# Altium project Senior Design.PrjPcb (part 2 of 2)

## Sheet Volt_Measurement.SchDoc
size Letter; SheetNumber: 2; SheetTotal: 3; SheetName: Volt Measurement
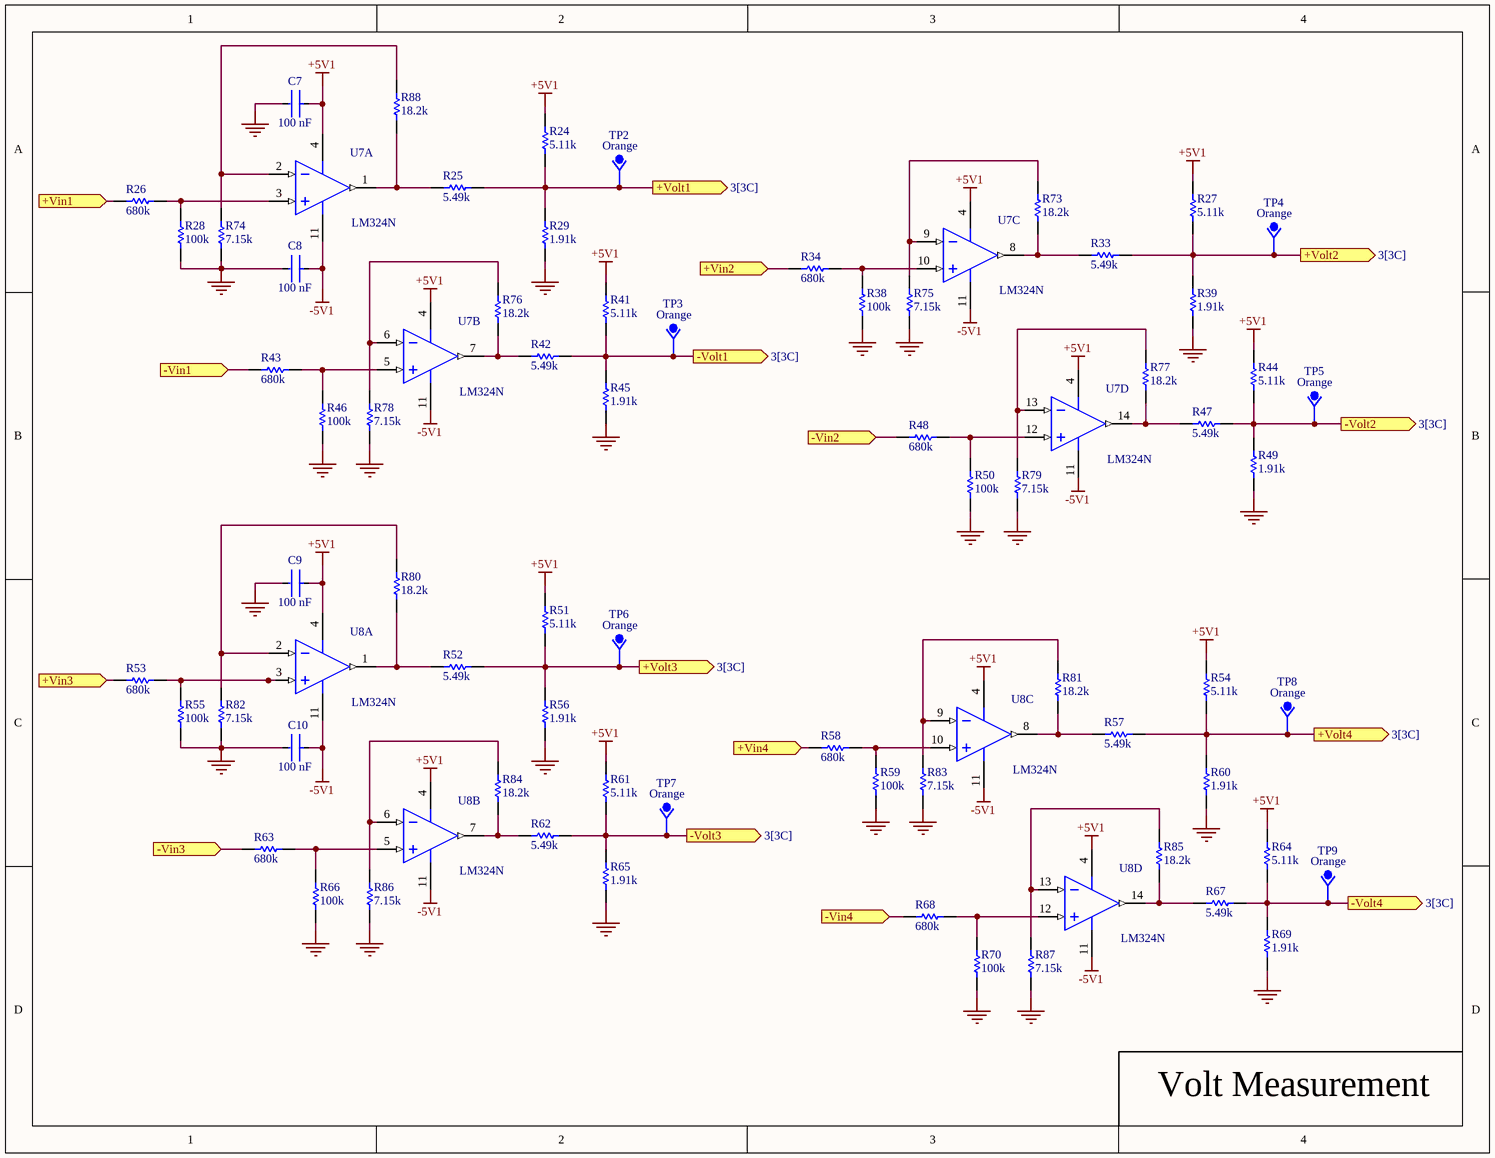
[diagram p1: Volt_Measurement.SchDoc]

### Parts
C7  value 100 nF  [FP-CC0805-0_85-MFG]  (hidden comment: 100nF)
C8  value 100 nF  [FP-CC0805-0_85-MFG]  (hidden comment: 100nF)
C9  value 100 nF  [FP-CC0805-0_85-MFG]  (hidden comment: 100nF)
C10  value 100 nF  [FP-CC0805-0_85-MFG]  (hidden comment: 100nF)
R24  value 5.11k  [0805 Res]  (hidden comment: 5.11k Ohm)
R25  value 5.49k  [0805 Res]  (hidden comment: 5.49k Ohm)
R26  value 680k  [0805 Res]  (hidden comment: 680k Ohm)
R27  value 5.11k  [0805 Res]  (hidden comment: 5.11k Ohm)
R28  value 100k  [0805 Res]  (hidden comment: 100k Ohm)
R29  value 1.91k  [0805 Res]  (hidden comment: 1.91k Ohm)
R33  value 5.49k  [0805 Res]  (hidden comment: 5.49k Ohm)
R34  value 680k  [0805 Res]  (hidden comment: 680k Ohm)
R38  value 100k  [0805 Res]  (hidden comment: 100k Ohm)
R39  value 1.91k  [0805 Res]  (hidden comment: 1.91k Ohm)
R41  value 5.11k  [0805 Res]  (hidden comment: 5.11k Ohm)
R42  value 5.49k  [0805 Res]  (hidden comment: 5.49k Ohm)
R43  value 680k  [0805 Res]  (hidden comment: 680k Ohm)
R44  value 5.11k  [0805 Res]  (hidden comment: 5.11k Ohm)
R45  value 1.91k  [0805 Res]  (hidden comment: 1.91k Ohm)
R46  value 100k  [0805 Res]  (hidden comment: 100k Ohm)
R47  value 5.49k  [0805 Res]  (hidden comment: 5.49k Ohm)
R48  value 680k  [0805 Res]  (hidden comment: 680k Ohm)
R49  value 1.91k  [0805 Res]  (hidden comment: 1.91k Ohm)
R50  value 100k  [0805 Res]  (hidden comment: 100k Ohm)
R51  value 5.11k  [0805 Res]  (hidden comment: 5.11k Ohm)
R52  value 5.49k  [0805 Res]  (hidden comment: 5.49k Ohm)
R53  value 680k  [0805 Res]  (hidden comment: 680k Ohm)
R54  value 5.11k  [0805 Res]  (hidden comment: 5.11k Ohm)
R55  value 100k  [0805 Res]  (hidden comment: 100k Ohm)
R56  value 1.91k  [0805 Res]  (hidden comment: 1.91k Ohm)
R57  value 5.49k  [0805 Res]  (hidden comment: 5.49k Ohm)
R58  value 680k  [0805 Res]  (hidden comment: 680k Ohm)
R59  value 100k  [0805 Res]  (hidden comment: 100k Ohm)
R60  value 1.91k  [0805 Res]  (hidden comment: 1.91k Ohm)
R61  value 5.11k  [0805 Res]  (hidden comment: 5.11k Ohm)
R62  value 5.49k  [0805 Res]  (hidden comment: 5.49k Ohm)
R63  value 680k  [0805 Res]  (hidden comment: 680k Ohm)
R64  value 5.11k  [0805 Res]  (hidden comment: 5.11k Ohm)
R65  value 1.91k  [0805 Res]  (hidden comment: 1.91k Ohm)
R66  value 100k  [0805 Res]  (hidden comment: 100k Ohm)
R67  value 5.49k  [0805 Res]  (hidden comment: 5.49k Ohm)
R68  value 680k  [0805 Res]  (hidden comment: 680k Ohm)
R69  value 1.91k  [0805 Res]  (hidden comment: 1.91k Ohm)
R70  value 100k  [0805 Res]  (hidden comment: 100k Ohm)
R73  value 18.2k  [0805 Res]  (hidden comment: 18.2k Ohm)
R74  value 7.15k  [0805 Res]  (hidden comment: 7.15k Ohm)
R75  value 7.15k  [0805 Res]  (hidden comment: 7.15k Ohm)
R76  value 18.2k  [0805 Res]  (hidden comment: 18.2k Ohm)
R77  value 18.2k  [0805 Res]  (hidden comment: 18.2k Ohm)
R78  value 7.15k  [0805 Res]  (hidden comment: 7.15k Ohm)
R79  value 7.15k  [0805 Res]  (hidden comment: 7.15k Ohm)
R80  value 18.2k  [0805 Res]  (hidden comment: 18.2k Ohm)
R81  value 18.2k  [0805 Res]  (hidden comment: 18.2k Ohm)
R82  value 7.15k  [0805 Res]  (hidden comment: 7.15k Ohm)
R83  value 7.15k  [0805 Res]  (hidden comment: 7.15k Ohm)
R84  value 18.2k  [0805 Res]  (hidden comment: 18.2k Ohm)
R85  value 18.2k  [0805 Res]  (hidden comment: 18.2k Ohm)
R86  value 7.15k  [0805 Res]  (hidden comment: 7.15k Ohm)
R87  value 7.15k  [0805 Res]  (hidden comment: 7.15k Ohm)
R88  value 18.2k  [0805 Res]  (hidden comment: 18.2k Ohm)
TP2  Color: Orange  [ORANGETP]  (hidden comment: TP (Orange))
TP3  Color: Orange  [ORANGETP]  (hidden comment: TP (Orange))
TP4  Color: Orange  [ORANGETP]  (hidden comment: TP (Orange))
TP5  Color: Orange  [ORANGETP]  (hidden comment: TP (Orange))
TP6  Color: Orange  [ORANGETP]  (hidden comment: TP (Orange))
TP7  Color: Orange  [ORANGETP]  (hidden comment: TP (Orange))
TP8  Color: Orange  [ORANGETP]  (hidden comment: TP (Orange))
TP9  Color: Orange  [ORANGETP]  (hidden comment: TP (Orange))
U7  Manufacturer Part Number: LM324N  [N0014A]  (hidden comment: 4CH Op-Amp)  (parts A,B,C,D of 4)
U8  Manufacturer Part Number: LM324N  [N0014A]  (hidden comment: 4CH Op-Amp)  (parts A,B,C,D of 4)

### Ports
+Vin1 (in), +Vin2 (in), +Vin3 (in), +Vin4 (in), +Volt1 (out, see 3[3C]), +Volt2 (out, see 3[3C]), +Volt3 (out, see 3[3C]), +Volt4 (out, see 3[3C]), -Vin1 (in), -Vin2 (in), -Vin3 (in), -Vin4 (in), -Volt1 (out, see 3[3C]), -Volt2 (out, see 3[3C]), -Volt3 (out, see 3[3C]), -Volt4 (out, see 3[3C])

### Nets
+5V1: C7.1 C9.1 R24.2 R27.2 R41.2 R44.2 R51.2 R54.2 R61.2 R64.2 U7.4(V+) U8.4(V+)
-5V1: C8.1 C10.1 U7.11(GND) U8.11(GND)
GND: C7.2 C8.2 C9.2 C10.2 R28.2 R29.1 R38.2 R39.1 R45.1 R46.2 R49.1 R50.2 R55.2 R56.1 R59.2 R60.1 R65.1 R66.2 R69.1 R70.2 R74.1 R75.1 R78.1 R79.1 R82.1 R83.1 R86.1 R87.1
NetR24_1: R24.1 R25.2 R29.2 TP2.1(TP) ; port +Volt1
NetR25_1: R25.1 R88.1 U7.1(OUT1)
NetR26_1: R26.1 ; port +Vin1
NetR26_2: R26.2 R28.1 U7.3(IN1+)
NetR27_1: R27.1 R33.2 R39.2 TP4.1(TP) ; port +Volt2
NetR33_1: R33.1 R73.1 U7.8(OUT3)
NetR34_1: R34.1 ; port +Vin2
NetR34_2: R34.2 R38.1 U7.10(IN3+)
NetR41_1: R41.1 R42.2 R45.2 TP3.1(TP) ; port -Volt1
NetR42_1: R42.1 R76.1 U7.7(OUT2)
NetR43_1: R43.1 ; port -Vin1
NetR43_2: R43.2 R46.1 U7.5(IN2+)
NetR44_1: R44.1 R47.2 R49.2 TP5.1(TP) ; port -Volt2
NetR47_1: R47.1 R77.1 U7.14(OUT4)
NetR48_1: R48.1 ; port -Vin2
NetR48_2: R48.2 R50.1 U7.12(IN4+)
NetR51_1: R51.1 R52.2 R56.2 TP6.1(TP) ; port +Volt3
NetR52_1: R52.1 R80.1 U8.1(OUT1)
NetR53_1: R53.1 ; port +Vin3
NetR53_2: R53.2 R55.1 U8.3(IN1+)
NetR54_1: R54.1 R57.2 R60.2 TP8.1(TP) ; port +Volt4
NetR57_1: R57.1 R81.1 U8.8(OUT3)
NetR58_1: R58.1 ; port +Vin4
NetR58_2: R58.2 R59.1 U8.10(IN3+)
NetR61_1: R61.1 R62.2 R65.2 TP7.1(TP) ; port -Volt3
NetR62_1: R62.1 R84.1 U8.7(OUT2)
NetR63_1: R63.1 ; port -Vin3
NetR63_2: R63.2 R66.1 U8.5(IN2+)
NetR64_1: R64.1 R67.2 R69.2 TP9.1(TP) ; port -Volt4
NetR67_1: R67.1 R85.1 U8.14(OUT4)
NetR68_1: R68.1 ; port -Vin4
NetR68_2: R68.2 R70.1 U8.12(IN4+)
NetR73_2: R73.2 R75.2 U7.9(IN3-)
NetR74_2: R74.2 R88.2 U7.2(IN1-)
NetR76_2: R76.2 R78.2 U7.6(IN2-)
NetR77_2: R77.2 R79.2 U7.13(IN4-)
NetR80_2: R80.2 R82.2 U8.2(IN1-)
NetR81_2: R81.2 R83.2 U8.9(IN3-)
NetR84_2: R84.2 R86.2 U8.6(IN2-)
NetR85_2: R85.2 R87.2 U8.13(IN4-)

### Library data of the parts
C7-C10 = CMP-1036-04402-6: CAP CER 0.1UF 16V X7R 0805; Manufacturer Part Number: CC0805KRX7R7BB104; Manufacturer: Yageo; Material: Ceramic; Tolerance: 0.1; Temperature: -30°C to +85°C; Lead Free: Yes; Footprint Url: http://www.yageo.com/exep/pages/download/literatures/UPY-C_GEN_24.pdf; Voltage Rating: 16 V; Package: CC0805-0.85; RoHS: TRUE; Digikey Description: CAP CER 0.1UF 16V X7R 0805; Category: Cap; Octopart: https://octopart.com/cc0805krx7r7bb104-yageo-39467769; Capacitance: 100 nF; Device Class L3: Ceramic Capacitors; ComponentLink2URL: http://www.yageo.com/documents/recent/UPY-GPHC_Y5V_6.3V-to-50V_8.pdf; Temperature Range Low: -30°C; Mouser Description: Multilayer Ceramic Capacitors MLCC - SMD/SMT 100nF 16V X7R 10%; Automotive: No; Device Class L2: Capacitors; Height: 0.95mm; ComponentLink2Description: Datasheet; Temperature Characteristic: X7R; Ipc Land Pattern Name: CAPC200125X85; Device Class L1: Passive Components; Temperature Range High: +85°C
R24 R27 R41 R44 R51 R54 R61 R64 = Res1: Fixed Resistor, Metal Glaze/thick Film, 0.125W, 5110ohm, 150V, 1% +/-Tol, 100ppm/Cel, Surface Mount, 0805; Manufacturer: Stackpole Electronics; Manufacturer Part Number: RMCF0805FT5K11; Power: 125mW; Rated Temperature: 70°C; Temperature Coefficient (ppm/Cel): 100; Package Height: 0.5mm; Package Length: 2mm; Package Width: 1.25mm; Reference Standard: AEC-Q200; Published: 8-Jun-2000; LatestRevisionDate: 17-Jul-2002; LatestRevisionNote: Re-released for DXP Platform.; PackageReference: AXIAL-0.3; Publisher: Altium Limited; PackageDescription: Axial Device, Thru-Hole; 2 Leads; 0.3 in Pin Spacing; Supplier 1: Avnet; Supplier Part Number 1: RMCF0805FT5K11; RoHS: Yes; Category: Chip SMD Resistors; Stock 1: 240000; Pricing 1: 5000=0.00252, 10000=0.00248, 20000=0.00245, 30000=0.00241, 40000=0.00238 (USD); Mounting Technology: Surface Mount; Pins: 2; Package Shape: Rectangular; Case/Package: 0805; Terminal Finish: Nickel; Min Operating Temperature: -55°C; Max Operating Temperature: 155°C; Tolerance: 1%; JESD-609 Code: e3; Resistor Type: FIXED RESISTOR; Construction: Rectangular; Packaging: Tape and Reel; Technology: METAL GLAZE/THICK FILM; Termination: Wraparound; Working Voltage: 150V; Reach SVHC Compliant: Yes; RoHS Compliant: Yes; ComponentLink1URL: https://datasheet.ciiva.com:443/pdfs/VipMasterIC/IC/SEIE/SEIE-S-A0009541969/SEIE-S-A0009541969-1.pdf?src-supplier=IHS+Markit; ComponentLink1Description: https://datasheet.ciiva.com:443/pdfs/VipMasterIC/IC/SEIE/SEIE-S-A0009541969/SEIE-S-A0009541969-1.pdf?src-supplier=IHS+Markit; ComponentLink2URL: https://datasheet.ciiva.com/15193/getdatasheetpartid-409010-15193607.pdf?src-supplier=Verical; ComponentLink2Description: https://datasheet.ciiva.com/15193/getdatasheetpartid-409010-15193607.pdf?src-supplier=Verical
R25 R33 R42 R47 R52 R57 R62 R67 = Res1: Fixed Resistor, Metal Glaze/thick Film, 0.125W, 5490ohm, 150V, 1% +/-Tol, 100ppm/Cel, Surface Mount, 0805; Manufacturer: Stackpole Electronics; Manufacturer Part Number: RMCF0805FT5K49; Power: 125mW; Rated Temperature: 70°C; Temperature Coefficient (ppm/Cel): 100; Package Height: 0.5mm; Package Length: 2mm; Package Width: 1.25mm; Reference Standard: AEC-Q200; Published: 8-Jun-2000; LatestRevisionDate: 17-Jul-2002; LatestRevisionNote: Re-released for DXP Platform.; PackageReference: AXIAL-0.3; Publisher: Altium Limited; PackageDescription: Axial Device, Thru-Hole; 2 Leads; 0.3 in Pin Spacing; Supplier 1: Avnet; Supplier Part Number 1: RMCF0805FT5K49; RoHS: Yes; Category: Chip SMD Resistors; Stock 1: 50000; Pricing 1: 5000=0.00252, 10000=0.00248, 20000=0.00245, 30000=0.00241, 40000=0.00238 (USD); Mounting Technology: Surface Mount; Pins: 2; Package Shape: Rectangular; Case/Package: 0805; Terminal Finish: Nickel; Min Operating Temperature: -55°C; Max Operating Temperature: 155°C; Tolerance: 1%; JESD-609 Code: e3; Resistor Type: FIXED RESISTOR; Construction: Rectangular; Packaging: Tape and Reel; Technology: METAL GLAZE/THICK FILM; Termination: Wraparound; Working Voltage: 150V; Reach SVHC Compliant: Yes; RoHS Compliant: Yes; ComponentLink1URL: https://datasheet.ciiva.com:443/pdfs/VipMasterIC/IC/SEIE/SEIE-S-A0009541969/SEIE-S-A0009541969-1.pdf?src-supplier=IHS+Markit; ComponentLink1Description: https://datasheet.ciiva.com:443/pdfs/VipMasterIC/IC/SEIE/SEIE-S-A0009541969/SEIE-S-A0009541969-1.pdf?src-supplier=IHS+Markit; ComponentLink2URL: https://www.seielect.com/catalog/sei-rmcf_rmcp.pdf?src-supplier=Digikey; ComponentLink2Description: https://www.seielect.com/catalog/sei-rmcf_rmcp.pdf?src-supplier=Digikey; ComponentLink3URL: https://www.seielect.com/catalog/SEI-RMCF_RMCP.pdf?src-supplier=Avnet; ComponentLink3Description: https://www.seielect.com/catalog/SEI-RMCF_RMCP.pdf?src-supplier=Avnet
R26 R34 R43 R48 R53 R58 R63 R68 = Res1: Fixed Resistor, Metal Glaze/thick Film, 0.125W, 680000ohm, 150V, 1% +/-Tol, 100ppm/Cel, Surface Mount, 0805; Manufacturer: Stackpole Electronics; Manufacturer Part Number: RMCF0805FT680K; Power: 125mW; Rated Temperature: 70°C; Temperature Coefficient (ppm/Cel): 100; Package Height: 0.5mm; Package Length: 2mm; Package Width: 1.25mm; Reference Standard: AEC-Q200; Published: 8-Jun-2000; LatestRevisionDate: 17-Jul-2002; LatestRevisionNote: Re-released for DXP Platform.; PackageReference: AXIAL-0.3; Publisher: Altium Limited; PackageDescription: Axial Device, Thru-Hole; 2 Leads; 0.3 in Pin Spacing; Supplier 1: Avnet; Supplier Part Number 1: RMCF0805FT680K; RoHS: Yes; Category: Chip SMD Resistors; Stock 1: 95000; Pricing 1: 5000=0.00252, 10000=0.00248, 20000=0.00245, 30000=0.00241, 40000=0.00238 (USD); Mounting Technology: Surface Mount; Pins: 2; Package Shape: Rectangular; Case/Package: 0805; Terminal Finish: Nickel; Min Operating Temperature: -55°C; Max Operating Temperature: 155°C; Tolerance: 1%; JESD-609 Code: e3; Resistor Type: FIXED RESISTOR; Construction: Rectangular; Packaging: Tape and Reel; Technology: METAL GLAZE/THICK FILM; Termination: Wraparound; Working Voltage: 150V; Reach SVHC Compliant: Yes; RoHS Compliant: Yes; ComponentLink1URL: https://datasheet.ciiva.com:443/pdfs/VipMasterIC/IC/SEIE/SEIE-S-A0009541969/SEIE-S-A0009541969-1.pdf?src-supplier=IHS+Markit; ComponentLink1Description: https://datasheet.ciiva.com:443/pdfs/VipMasterIC/IC/SEIE/SEIE-S-A0009541969/SEIE-S-A0009541969-1.pdf?src-supplier=IHS+Markit; ComponentLink2URL: https://www.seielect.com/catalog/sei-packaging.pdf?src-supplier=Digikey; ComponentLink2Description: https://www.seielect.com/catalog/sei-packaging.pdf?src-supplier=Digikey; ComponentLink3URL: https://www.seielect.com/catalog/SEI-RMCF_RMCP.pdf?src-supplier=Avnet; ComponentLink3Description: https://www.seielect.com/catalog/SEI-RMCF_RMCP.pdf?src-supplier=Avnet; ComponentLink4URL: https://datasheet.octopart.com/RMCF0805FT680K-Stackpole-Electronics-datasheet-140082676.pdf?src-supplier=LKR; ComponentLink4Description: https://datasheet.octopart.com/RMCF0805FT680K-Stackpole-Electronics-datasheet-140082676.pdf?src-supplier=LKR
R28 R38 R46 R50 R55 R59 R66 R70 = Res1: Fixed Resistor, Metal Glaze/thick Film, 0.125W, 100000ohm, 150V, 1% +/-Tol, 100ppm/Cel, Surface Mount, 0805; Manufacturer: Stackpole Electronics; Manufacturer Part Number: RMCF0805FT100K; Power: 125mW; Rated Temperature: 70°C; Temperature Coefficient (ppm/Cel): 100; Package Height: 0.5mm; Package Length: 2mm; Package Width: 1.25mm; Reference Standard: AEC-Q200; Published: 8-Jun-2000; LatestRevisionDate: 17-Jul-2002; LatestRevisionNote: Re-released for DXP Platform.; PackageReference: AXIAL-0.3; Publisher: Altium Limited; PackageDescription: Axial Device, Thru-Hole; 2 Leads; 0.3 in Pin Spacing; Supplier 1: Avnet; Supplier Part Number 1: RMCF0805FT100K; RoHS: Yes; Category: Chip SMD Resistors; Stock 1: 1060000; Pricing 1: 5000=0.00252, 10000=0.00248, 20000=0.00245, 30000=0.00241, 40000=0.00238 (USD); Mounting Technology: Surface Mount; Pins: 2; Package Shape: Rectangular; Case/Package: 0805; Terminal Finish: Nickel; Min Operating Temperature: -55°C; Max Operating Temperature: 155°C; Tolerance: 1%; JESD-609 Code: e3; Resistor Type: FIXED RESISTOR; Construction: Rectangular; Packaging: Tape and Reel; Technology: METAL GLAZE/THICK FILM; Termination: Wraparound; Working Voltage: 150V; Reach SVHC Compliant: Yes; RoHS Compliant: Yes; ComponentLink1URL: https://datasheet.ciiva.com:443/pdfs/VipMasterIC/IC/SEIE/SEIE-S-A0009541969/SEIE-S-A0009541969-1.pdf?src-supplier=IHS+Markit; ComponentLink1Description: https://datasheet.ciiva.com:443/pdfs/VipMasterIC/IC/SEIE/SEIE-S-A0009541969/SEIE-S-A0009541969-1.pdf?src-supplier=IHS+Markit; ComponentLink2URL: http://components.arrow.com/part/dataview/50568053S7005095N1174?src-supplier=Arrow+Electronics; ComponentLink2Description: http://components.arrow.com/part/dataview/50568053S7005095N1174?src-supplier=Arrow+Electronics; ComponentLink3URL: https://www.seielect.com/catalog/SEI-Packaging.pdf?src-supplier=Digikey; ComponentLink3Description: https://www.seielect.com/catalog/SEI-Packaging.pdf?src-supplier=Digikey; ComponentLink4URL: https://www.seielect.com/catalog/SEI-RMCF_RMCP.pdf?src-supplier=Avnet; ComponentLink4Description: https://www.seielect.com/catalog/SEI-RMCF_RMCP.pdf?src-supplier=Avnet; ComponentLink5URL: http://www.onlinecomponents.com/productFiles/mf-SEI/sei-rmcp.pdf?src-supplier=Onlinecomponents.com; ComponentLink5Description: http://www.onlinecomponents.com/productFiles/mf-SEI/sei-rmcp.pdf?src-supplier=Onlinecomponents.com; ComponentLink6URL: http://www.seielect.com/catalog/sei-rmc.pdf?src-supplier=Future+Electronics; ComponentLink6Description: http://www.seielect.com/catalog/sei-rmc.pdf?src-supplier=Future+Electronics; ComponentLink7URL: https://www.verical.com/server-webapp/html/getDatasheet?partID=360692&src-supplier=Verical; ComponentLink7Description: https://www.verical.com/server-webapp/html/getDatasheet?partID=360692&src-supplier=Verical; ComponentLink8URL: https://datasheet.octopart.com/RMCF0805FT100K-Stackpole-Electronics-datasheet-11547379.pdf?src-supplier=Future+Electronics; ComponentLink8Description: https://datasheet.octopart.com/RMCF0805FT100K-Stackpole-Electronics-datasheet-11547379.pdf?src-supplier=Future+Electronics; ComponentLink9URL: https://datasheet.octopart.com/RMCF0805FT100K-Stackpole-Electronics-datasheet-155966809.pdf?src-supplier=Electro+Sonic; ComponentLink9Description: https://datasheet.octopart.com/RMCF0805FT100K-Stackpole-Electronics-datasheet-155966809.pdf?src-supplier=Electro+Sonic; ComponentLink10URL: https://datasheet.octopart.com/RMCF0805FT100K-Stackpole-Electronics-datasheet-154799224.pdf?src-supplier=Master+Electronics; ComponentLink10Description: https://datasheet.octopart.com/RMCF0805FT100K-Stackpole-Electronics-datasheet-154799224.pdf?src-supplier=Master+Electronics
R29 R39 R45 R49 R56 R60 R65 R69 = Res1: Fixed Resistor, Metal Glaze/thick Film, 0.125W, 1910ohm, 150V, 1% +/-Tol, 100ppm/Cel, Surface Mount, 0805; Manufacturer: Stackpole Electronics; Manufacturer Part Number: RMCF0805FT1K91; Power: 125mW; Rated Temperature: 70°C; Temperature Coefficient (ppm/Cel): 100; Package Height: 0.5mm; Package Length: 2mm; Package Width: 1.25mm; Reference Standard: AEC-Q200; Published: 8-Jun-2000; LatestRevisionDate: 17-Jul-2002; LatestRevisionNote: Re-released for DXP Platform.; PackageReference: AXIAL-0.3; Publisher: Altium Limited; PackageDescription: Axial Device, Thru-Hole; 2 Leads; 0.3 in Pin Spacing; Supplier 1: Avnet; Supplier Part Number 1: RMCF0805FT1K91; RoHS: Yes; Category: Chip SMD Resistors; Stock 1: 175000; Pricing 1: 5000=0.00252, 10000=0.00248, 20000=0.00245, 30000=0.00241, 40000=0.00238 (USD); Mounting Technology: Surface Mount; Pins: 2; Package Shape: Rectangular; Case/Package: 0805; Terminal Finish: Nickel; Min Operating Temperature: -55°C; Max Operating Temperature: 155°C; Tolerance: 1%; JESD-609 Code: e3; Resistor Type: FIXED RESISTOR; Construction: Rectangular; Packaging: Tape and Reel; Technology: METAL GLAZE/THICK FILM; Termination: Wraparound; Working Voltage: 150V; Reach SVHC Compliant: Yes; RoHS Compliant: Yes; ComponentLink1URL: https://datasheet.ciiva.com:443/pdfs/VipMasterIC/IC/SEIE/SEIE-S-A0009541969/SEIE-S-A0009541969-1.pdf?src-supplier=IHS+Markit; ComponentLink1Description: https://datasheet.ciiva.com:443/pdfs/VipMasterIC/IC/SEIE/SEIE-S-A0009541969/SEIE-S-A0009541969-1.pdf?src-supplier=IHS+Markit; ComponentLink2URL: https://www.seielect.com/catalog/sei-rmcf_rmcp.pdf?src-supplier=Digikey; ComponentLink2Description: https://www.seielect.com/catalog/sei-rmcf_rmcp.pdf?src-supplier=Digikey; ComponentLink3URL: https://www.seielect.com/catalog/SEI-Packaging.pdf?src-supplier=Digikey; ComponentLink3Description: https://www.seielect.com/catalog/SEI-Packaging.pdf?src-supplier=Digikey; ComponentLink4URL: http://www.seielect.com/Catalog/SEI-RMCF_RMCP.pdf?src-supplier=Digikey; ComponentLink4Description: http://www.seielect.com/Catalog/SEI-RMCF_RMCP.pdf?src-supplier=Digikey; ComponentLink5URL: https://www.seielect.com/catalog/SEI-RMCF_RMCP.pdf?src-supplier=Avnet; ComponentLink5Description: https://www.seielect.com/catalog/SEI-RMCF_RMCP.pdf?src-supplier=Avnet
R73 R76 R77 R80 R81 R84 R85 R88 = Res1: Fixed Resistor, Metal Glaze/thick Film, 0.125W, 18200ohm, 150V, 1% +/-Tol, 100ppm/Cel, Surface Mount, 0805; Manufacturer: Stackpole Electronics; Manufacturer Part Number: RMCF0805FT18K2; Power: 125mW; Rated Temperature: 70°C; Temperature Coefficient (ppm/Cel): 100; Package Height: 0.5mm; Package Length: 2mm; Package Width: 1.25mm; Reference Standard: AEC-Q200; Published: 8-Jun-2000; LatestRevisionDate: 17-Jul-2002; LatestRevisionNote: Re-released for DXP Platform.; PackageReference: AXIAL-0.3; Publisher: Altium Limited; PackageDescription: Axial Device, Thru-Hole; 2 Leads; 0.3 in Pin Spacing; Supplier 1: Avnet; Supplier Part Number 1: RMCF0805FT18K2; RoHS: Yes; Category: Chip SMD Resistors; Stock 1: 90000; Pricing 1: 5000=0.00252, 10000=0.00248, 20000=0.00245, 30000=0.00241, 40000=0.00238 (USD); Mounting Technology: Surface Mount; Pins: 2; Package Shape: Rectangular; Case/Package: 0805; Terminal Finish: Nickel; Min Operating Temperature: -55°C; Max Operating Temperature: 155°C; Tolerance: 1%; JESD-609 Code: e3; Resistor Type: FIXED RESISTOR; Construction: Rectangular; Packaging: Tape and Reel; Technology: METAL GLAZE/THICK FILM; Termination: Wraparound; Working Voltage: 150V; Reach SVHC Compliant: Yes; RoHS Compliant: Yes; ComponentLink1URL: https://datasheet.ciiva.com:443/pdfs/VipMasterIC/IC/SEIE/SEIE-S-A0009541969/SEIE-S-A0009541969-1.pdf?src-supplier=IHS+Markit; ComponentLink1Description: https://datasheet.ciiva.com:443/pdfs/VipMasterIC/IC/SEIE/SEIE-S-A0009541969/SEIE-S-A0009541969-1.pdf?src-supplier=IHS+Markit; ComponentLink2URL: http://components.arrow.com/part/dataview/40964083S7077184N1174?src-supplier=Arrow+Electronics; ComponentLink2Description: http://components.arrow.com/part/dataview/40964083S7077184N1174?src-supplier=Arrow+Electronics; ComponentLink3URL: https://www.seielect.com/catalog/SEI-RMCF_RMCP.pdf?src-supplier=Avnet; ComponentLink3Description: https://www.seielect.com/catalog/SEI-RMCF_RMCP.pdf?src-supplier=Avnet; ComponentLink4URL: https://www.seielect.com/catalog/sei-rmcf_rmcp.pdf?src-supplier=Digikey; ComponentLink4Description: https://www.seielect.com/catalog/sei-rmcf_rmcp.pdf?src-supplier=Digikey
R74 R75 R78 R79 R82 R83 R86 R87 = Res1: Fixed Resistor, Metal Glaze/thick Film, 0.125W, 7150ohm, 150V, 1% +/-Tol, 100ppm/Cel, Surface Mount, 0805; Manufacturer: Stackpole Electronics; Manufacturer Part Number: RMCF0805FT7K15; Power: 125mW; Rated Temperature: 70°C; Temperature Coefficient (ppm/Cel): 100; Package Height: 0.5mm; Package Length: 2mm; Package Width: 1.25mm; Reference Standard: AEC-Q200; Published: 8-Jun-2000; LatestRevisionDate: 17-Jul-2002; LatestRevisionNote: Re-released for DXP Platform.; PackageReference: AXIAL-0.3; Publisher: Altium Limited; PackageDescription: Axial Device, Thru-Hole; 2 Leads; 0.3 in Pin Spacing; Supplier 1: Avnet; Supplier Part Number 1: RMCF0805FT7K15; RoHS: Yes; Category: Chip SMD Resistors; Stock 1: 65000; Pricing 1: 5000=0.00252, 10000=0.00248, 20000=0.00245, 30000=0.00241, 40000=0.00238 (USD); Mounting Technology: Surface Mount; Pins: 2; Package Shape: Rectangular; Case/Package: 0805; Terminal Finish: Nickel; Min Operating Temperature: -55°C; Max Operating Temperature: 155°C; Tolerance: 1%; JESD-609 Code: e3; Resistor Type: FIXED RESISTOR; Construction: Rectangular; Packaging: Tape and Reel; Technology: METAL GLAZE/THICK FILM; Termination: Wraparound; Working Voltage: 150V; Reach SVHC Compliant: Yes; RoHS Compliant: Yes; ComponentLink1URL: https://datasheet.ciiva.com:443/pdfs/VipMasterIC/IC/SEIE/SEIE-S-A0009541969/SEIE-S-A0009541969-1.pdf?src-supplier=IHS+Markit; ComponentLink1Description: https://datasheet.ciiva.com:443/pdfs/VipMasterIC/IC/SEIE/SEIE-S-A0009541969/SEIE-S-A0009541969-1.pdf?src-supplier=IHS+Markit; ComponentLink2URL: http://components.arrow.com/part/dataview/44987969S7384101N1174?src-supplier=Arrow+Electronics; ComponentLink2Description: http://components.arrow.com/part/dataview/44987969S7384101N1174?src-supplier=Arrow+Electronics; ComponentLink3URL: https://www.seielect.com/catalog/sei-rmcf_rmcp.pdf?src-supplier=Digikey; ComponentLink3Description: https://www.seielect.com/catalog/sei-rmcf_rmcp.pdf?src-supplier=Digikey; ComponentLink4URL: https://www.seielect.com/catalog/SEI-Packaging.pdf?src-supplier=Digikey; ComponentLink4Description: https://www.seielect.com/catalog/SEI-Packaging.pdf?src-supplier=Digikey; ComponentLink5URL: https://www.seielect.com/catalog/SEI-RMCF_RMCP.pdf?src-supplier=Avnet; ComponentLink5Description: https://www.seielect.com/catalog/SEI-RMCF_RMCP.pdf?src-supplier=Avnet
TP2-TP9 = TP: Orange Test Point; Manufacturer P/N: 5013; Manufacturer: Keystone; Manufacturer Part Number: 5003; Description: Interconnection Device; Supplier 1: Mouser; Supplier Part Number 1: 534-5003; RoHS: Yes; Category: Connectors; Stock 1: 79700; Pricing 1: 1=0.29, 10=0.29, 50=0.262, 100=0.222, 1000=0.173, 10000=0.143 (USD); Contact Finish - Termination: Silver (Ag); Connector Type: Interconnection Device; JESD-609 Code: e4; Reach SVHC Compliant: Yes; RoHS Compliant: Yes; ComponentLink1URL: https://datasheet.ciiva.com:443/pdfs/VipMasterIC/IC/KEYC/KEYCS01036/KEYCS02044-1.pdf?src-supplier=IHS+Markit; ComponentLink1Description: https://datasheet.ciiva.com:443/pdfs/VipMasterIC/IC/KEYC/KEYCS01036/KEYCS02044-1.pdf?src-supplier=IHS+Markit; ComponentLink2URL: https://datasheet.ciiva.com/22631/1703983-22631103.pdf?src-supplier=Element14; ComponentLink2Description: https://datasheet.ciiva.com/22631/1703983-22631103.pdf?src-supplier=Element14; ComponentLink3URL: https://datasheet.ciiva.com/4598/5000-5004-4598618.pdf?src-supplier=Mouser; ComponentLink3Description: https://datasheet.ciiva.com/4598/5000-5004-4598618.pdf?src-supplier=Mouser; ComponentLink4URL: https://datasheet.ciiva.com/16885/70182825-16885788.pdf?src-supplier=Allied+Electronics; ComponentLink4Description: https://datasheet.ciiva.com/16885/70182825-16885788.pdf?src-supplier=Allied+Electronics; ComponentLink5URL: https://datasheet.ciiva.com/1454/1703983-1454826.pdf?src-supplier=Element14; ComponentLink5Description: https://datasheet.ciiva.com/1454/1703983-1454826.pdf?src-supplier=Element14
U7 U8 = CMP-0055-00082-3: Low Power Quad Operational Amplifier, 14-pin MDIP; Manufacturer: Texas Instruments; CompType: Amplifiers; PowerWise: N; PackageTopMarking: NSUZXYYTTE#*LM324N; PackageDescription: MDIP, .750 x .250 x.130in, 14 Lead, .100in Pitch; Package Reference: N0014A; RoHS: N; Code_JEDEC: MS-001-AA; ComponentLink1URL: http://www.ti.com/general/docs/lit/getliterature.tsp?genericPartNumber=LM324&fileType=pdf; ComponentLink1Description: Datasheet URL; PinCount: 14

## Sheet Data-Power.SchDoc
size Letter; SheetNumber: 3; SheetTotal: 3; SPICEModelCacheLQOFTWCY: <root> / <DocumentId>LQOFTWCY</DocumentId> / </root>; SheetName: Data & Power
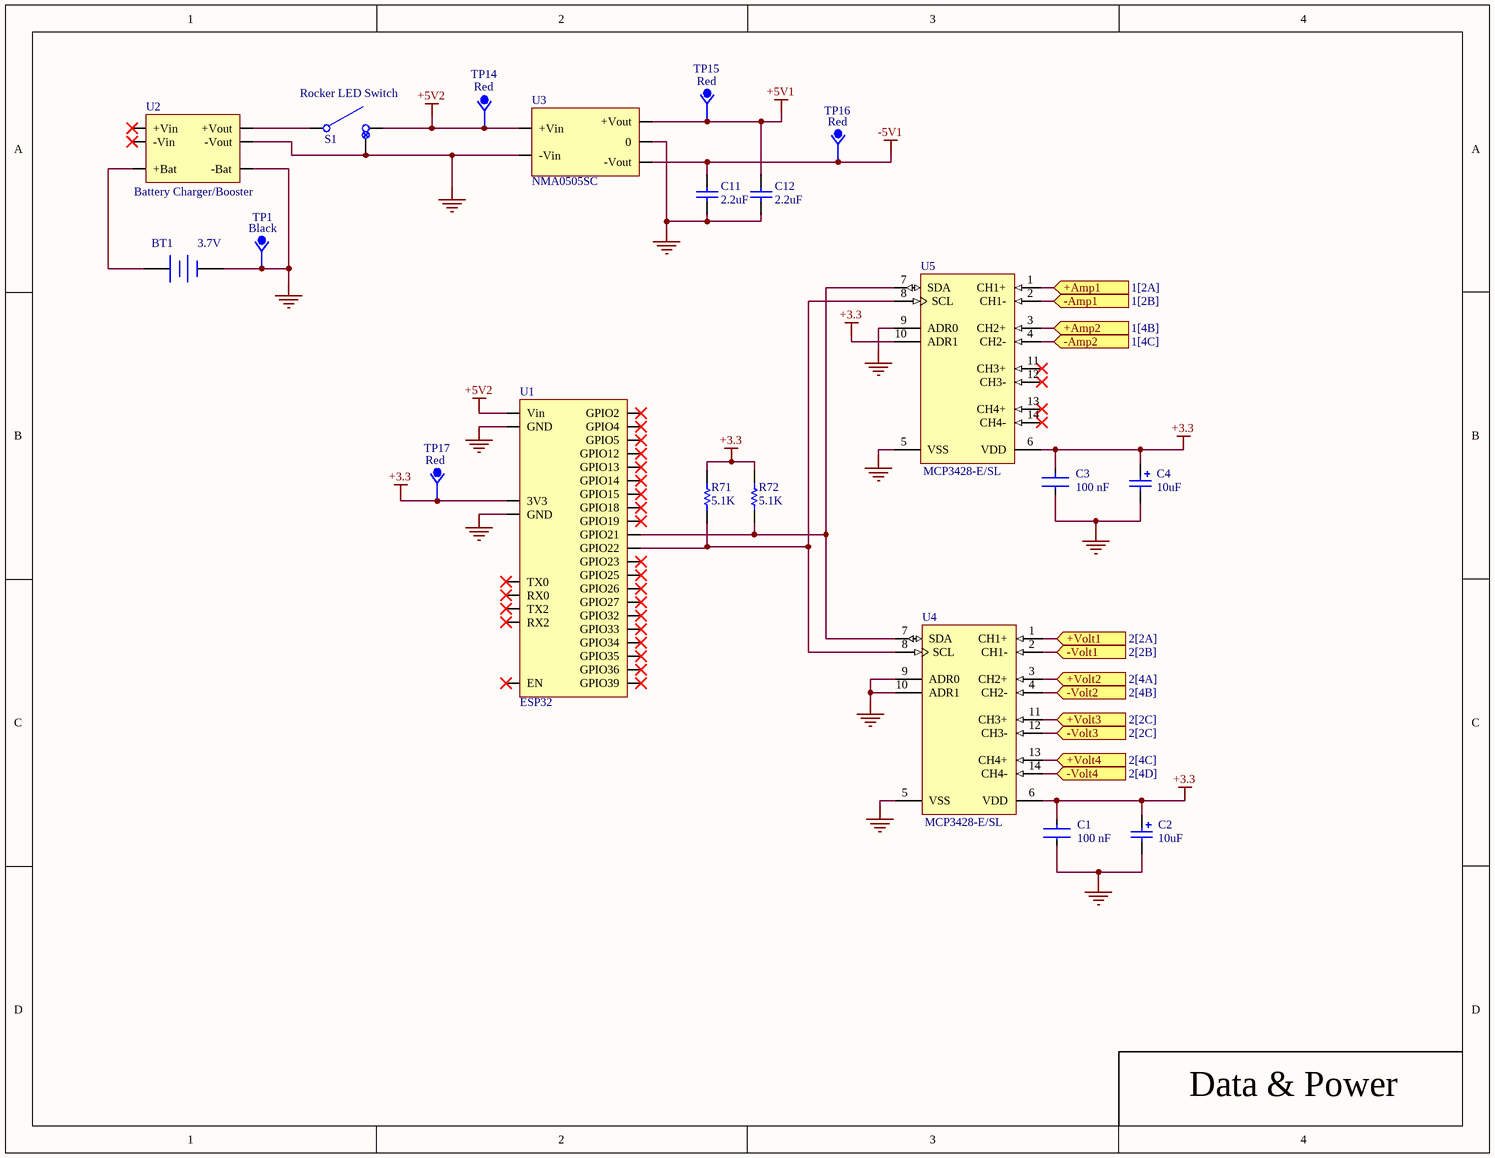
[diagram p2: Data-Power.SchDoc]

### Parts
BT1  Voltage: 3.7V  [BAT-2]  (hidden comment: 3.7V Battery)
C1  value 100 nF  [FP-CC0805-0_85-MFG]  (hidden comment: 100nF)
C2  value 10uF  [0805 Tant Cap]  (hidden comment: TCTP1C106M8R)
C3  value 100 nF  [FP-CC0805-0_85-MFG]  (hidden comment: 100nF)
C4  value 10uF  [0805 Tant Cap]  (hidden comment: TCTP1C106M8R)
C11  2.2uF  [CAPC2013X135X50ML10T20]
C12  2.2uF  [CAPC2013X135X50ML10T20]
R71  value 5.1K  [0805 Res]  (hidden comment: 5.11k Ohm)
R72  value 5.1K  [0805 Res]  (hidden comment: 5.11k Ohm)
S1  Rocker LED Switch  [SW]
TP1  Color: Black  [BlackTP]  (hidden comment: TP (Black))
TP14  Color: Red  [RedTP]  (hidden comment: TP (Red))
TP15  Color: Red  [RedTP]  (hidden comment: TP (Red))
TP16  Color: Red  [RedTP]  (hidden comment: TP (Red))
TP17  Color: Red  [RedTP]  (hidden comment: TP (Red))
U1  ESP32  [ESP32]
U2  Battery Charger/Booster  [Batt Chrg/Bst]
U3  DC DC Converter  [NMA0505SC]  (value not drawn)
U4  Manufacturer Part Number: MCP3428-E/SL  [SOIC-SL14_N]  (hidden comment: 4Ch ADC)
U5  Manufacturer Part Number: MCP3428-E/SL  [SOIC-SL14_N]  (hidden comment: 4Ch ADC)

### Ports
+Amp1 (in, see 1[2A]), +Amp2 (in, see 1[4B]), +Volt1 (in, see 2[2A]), +Volt2 (in, see 2[4A]), +Volt3 (in, see 2[2C]), +Volt4 (in, see 2[4C]), -Amp1 (in, see 1[2B]), -Amp2 (in, see 1[4C]), -Volt1 (in, see 2[2B]), -Volt2 (in, see 2[4B]), -Volt3 (in, see 2[2C]), -Volt4 (in, see 2[4D])

### Nets
+3.3: C1.1 C2.1 C3.1 C4.1 R71.2 R72.2 TP17.1(TP) U1.?3(3V3) U4.6(VDD) U5.6(VDD) U5.10(ADR1)
+5V1: C12.2 TP15.1(TP) U3.?4(+Vout)
+5V2: S1.?2 TP14.1(TP) U1.?1(Vin) U3.?1(+Vin)
-5V1: C11.2 TP16.1(TP) U3.?5(-Vout)
GND: BT1.2(-) C1.2 C2.2 C3.2 C4.2 C11.1 C12.1 S1.?3 TP1.1(TP) U1.?2(GND) U1.?4(GND) U2.?2(-Bat) U2.?4(-Vout) U3.?2(-Vin) U3.?3(0) U4.5(VSS) U4.9(ADR0) U4.10(ADR1) U5.5(VSS) U5.9(ADR0)
NetBT1_1: BT1.1(+) U2.?1(+Bat)
NetR10_1: U5.3(CH2+) ; port +Amp2
NetR17_1: U5.4(CH2-) ; port -Amp2
NetR24_1: U4.1(CH1+) ; port +Volt1
NetR27_1: U4.3(CH2+) ; port +Volt2
NetR30_1: U5.1(CH1+) ; port +Amp1
NetR35_1: U5.2(CH1-) ; port -Amp1
NetR41_1: U4.2(CH1-) ; port -Volt1
NetR44_1: U4.4(CH2-) ; port -Volt2
NetR51_1: U4.11(CH3+) ; port +Volt3
NetR54_1: U4.13(CH4+) ; port +Volt4
NetR61_1: U4.12(CH3-) ; port -Volt3
NetR64_1: U4.14(CH4-) ; port -Volt4
NetR71_1: R71.1 U1.39(GPIO22) U4.8(SCL) U5.8(SCL)
NetR72_1: R72.1 U1.42(GPIO21) U4.7(SDA) U5.7(SDA)
NetS1_?1: S1.?1 U2.?3(+Vout)

Not connected (* = marked no-connect by the designer): U1 5(GPIO36)* 8(GPIO39)* 9(EN)* 10(GPIO34)* 11(GPIO35)* 12(GPIO32)* 13(GPIO33)* 14(GPIO25)* 15(GPIO26)* 16(GPIO27)* 17(GPIO14)* 18(GPIO12)* 20(GPIO13)* 21(GPIO15)* 22(GPIO2)* 24(GPIO4)* 25(RX2)* 27(TX2)* 34(GPIO5)* 35(GPIO18)* 36(GPIO23)* 38(GPIO19)* 40(RX0)* 41(TX0)*; U2 ?5(+Vin)* ?6(-Vin)*; U5 11(CH3+)* 12(CH3-)* 13(CH4+)* 14(CH4-)*

### Library data of the parts
BT1 = Battery: 3.7V 1000mAh Battery with Protection Board; Manufacturer: Amazon(MakerFocus); Manufacturer Part Number: B07CXNQ3ZR; Published: 24-Mar-1999; LatestRevisionDate: 17-Jul-2002; LatestRevisionNote: Re-released for DXP Platform.; PackageReference: BAT-2; Publisher: Altium Limited; PackageDescription: Battery; 2 Leads
C1 C3 = CMP-1036-04402-6: as C7 on sheet Volt_Measurement; Temperature: -30°C to +85°C; Lead Free: Yes; Footprint Url: http://www.yageo.com/exep/pages/download/literatures/UPY-C_GEN_24.pdf; Voltage Rating: 16 V; Package: CC0805-0.85; RoHS: TRUE; Digikey Description: CAP CER 0.1UF 16V X7R 0805; Category: Cap; Octopart: https://octopart.com/cc0805krx7r7bb104-yageo-39467769; Capacitance: 100 nF; Device Class L3: Ceramic Capacitors; ComponentLink2URL: http://www.yageo.com/documents/recent/UPY-GPHC_Y5V_6.3V-to-50V_8.pdf; Temperature Range Low: -30°C; Mouser Description: Multilayer Ceramic Capacitors MLCC - SMD/SMT 100nF 16V X7R 10%; Automotive: No; Device Class L2: Capacitors; Height: 0.95mm; ComponentLink2Description: Datasheet; Temperature Characteristic: X7R; Ipc Land Pattern Name: CAPC200125X85; Device Class L1: Passive Components; Temperature Range High: +85°C
C2 C4 = Cap Pol2: Cap Tant 10UF 20% 16V 0805; Manufacturer: Kyocera AVX; Published: 8-Jun-2000; LatestRevisionDate: 17-Jul-2002; LatestRevisionNote: Re-released for DXP Platform.; PackageReference: POLAR0.8; Publisher: Altium Limited; PackageDescription: Polarized Capacitor; 2 Leads; Supplier 1: Digikey; Supplier Part Number 1: 478-TCTP1C106M8RCT-ND; Manufacturer Part Number: TCTP1C106M8R; RoHS: No; Category: Tantalum Capacitors; Stock 1: 17395; Pricing 1: 1=0.8, 10=0.512, 50=0.3954, 100=0.3578, 500=0.29124, 1000=0.26947 (USD); ComponentLink1URL: https://datasheet.octopart.com/TCTP1C106M8R-KYOCERA-AVX-datasheet-165512328.pdf?src-supplier=Future+Electronics; ComponentLink1Description: https://datasheet.octopart.com/TCTP1C106M8R-KYOCERA-AVX-datasheet-165512328.pdf?src-supplier=Future+Electronics
C11 C12 = CMP-2007-03455-1: Ceramic Capacitor, Multilayer, Ceramic, 16V, 10% +Tol, 10% -Tol, X7R, 15% TC, 2.2uF, Surface Mount, 0805; Manufacturer: Murata; Manufacturer Part Number: GRM21BR71C225KA12L; Multilayer: Yes; Supplier 1: Mouser; Supplier Part Number 1: 81-GRM21BR71C225KA2L; RoHS: Yes; Category: Ceramic Capacitors; Stock 1: 24749; Pricing 1: 1=0.33, 10=0.141, 50=0.141, 100=0.095, 1000=0.07, 10000=0.054 (USD); Mounting Technology: Surface Mount; Pins: 2; Dielectric Material: Ceramic; Package Shape: Rectangular; Case/Package: 0805; Terminal Finish: Nickel; Min Operating Temperature: -55°C; Max Operating Temperature: 125°C; JESD-609 Code: e3; Value: 2.2uF; Capacitor Type: Ceramic; Tolerance  (fill in as +-): 10%; Package Style: SMTMeter; Packaging: Tape and Reel; Tolerance (fill in as +-): 10%; Rated DC Voltage (URdc): 16V; Temperature Characteristics Code: X7R; Termination: Wraparound; Length: 2mm; Width: 1.25mm; Height: 1.25mm; Reach SVHC Compliant: Yes; RoHS Compliant: Yes; ComponentLink1URL: https://datasheet.ciiva.com:443/pdfs/VipMasterIC/IC/MURE/MURE-S-A0004349797/MURE-S-A0004361718-1.pdf?src-supplier=IHS+Markit; ComponentLink1Description: https://datasheet.ciiva.com:443/pdfs/VipMasterIC/IC/MURE/MURE-S-A0004349797/MURE-S-A0004361718-1.pdf?src-supplier=IHS+Markit
R71 R72 = Res1: as R24 on sheet Volt_Measurement; Published: 8-Jun-2000; LatestRevisionDate: 17-Jul-2002; LatestRevisionNote: Re-released for DXP Platform.; PackageReference: AXIAL-0.3; Publisher: Altium Limited; PackageDescription: Axial Device, Thru-Hole; 2 Leads; 0.3 in Pin Spacing; Supplier 1: Avnet; Supplier Part Number 1: RMCF0805FT5K11; RoHS: Yes; Category: Chip SMD Resistors; Stock 1: 255000; Pricing 1: 5000=0.00252, 10000=0.00248, 20000=0.00245, 30000=0.00241, 40000=0.00238 (USD); Mounting Technology: Surface Mount; Pins: 2; Package Shape: Rectangular; Case/Package: 0805; Terminal Finish: Nickel; Min Operating Temperature: -55°C; Max Operating Temperature: 155°C; Tolerance: 1%; JESD-609 Code: e3; Resistor Type: FIXED RESISTOR; Construction: Rectangular; Packaging: Tape and Reel; Technology: METAL GLAZE/THICK FILM; Termination: Wraparound; Working Voltage: 150V; Reach SVHC Compliant: Yes; RoHS Compliant: Yes; ComponentLink1URL: https://datasheet.ciiva.com:443/pdfs/VipMasterIC/IC/SEIE/SEIE-S-A0009541969/SEIE-S-A0009541969-1.pdf?src-supplier=IHS+Markit; ComponentLink1Description: https://datasheet.ciiva.com:443/pdfs/VipMasterIC/IC/SEIE/SEIE-S-A0009541969/SEIE-S-A0009541969-1.pdf?src-supplier=IHS+Markit; ComponentLink2URL: https://datasheet.ciiva.com/15193/getdatasheetpartid-409010-15193607.pdf?src-supplier=Verical; ComponentLink2Description: https://datasheet.ciiva.com/15193/getdatasheetpartid-409010-15193607.pdf?src-supplier=Verical
S1 = SW: Single-Pole, Single-Throw Rocket LED Switch; Manufacturer: Amazon(Nilight); Manufacturer Part Number: B07T1JG6BD
TP1 = TP: Black Test Point; Manufacturer: Keystone; Manufacturer P/N: 5001; Description: Interconnection Device; Supplier 1: Mouser; Supplier Part Number 1: 534-5001; Manufacturer Part Number: 5001; RoHS: Yes; Category: Connectors; Stock 1: 345950; Pricing 1: 1=0.29, 10=0.29, 25=0.262, 50=0.262, 100=0.222, 500=0.184, 1000=0.173, 2500=0.154, 5000=0.143, 10000=0.143 (USD); Contact Finish - Termination: Silver (Ag); JESD-609 Code: e4; Connector Type: Interconnection Device; Reach SVHC Compliant: Yes; RoHS Compliant: Yes; ComponentLink1URL: https://datasheet.ciiva.com:443/pdfs/VipMasterIC/IC/KEYC/KEYCS01036/KEYCS02044-1.pdf?src-supplier=IHS+Markit; ComponentLink1Description: https://datasheet.ciiva.com:443/pdfs/VipMasterIC/IC/KEYC/KEYCS01036/KEYCS02044-1.pdf?src-supplier=IHS+Markit; ComponentLink2URL: https://datasheet.ciiva.com/11836/0900766b8009b7c7-11836045.pdf?src-supplier=Rs; ComponentLink2Description: https://datasheet.ciiva.com/11836/0900766b8009b7c7-11836045.pdf?src-supplier=Rs; ComponentLink3URL: https://datasheet.ciiva.com/27052/1581986-27052611.pdf?src-supplier=Jameco; ComponentLink3Description: https://datasheet.ciiva.com/27052/1581986-27052611.pdf?src-supplier=Jameco; ComponentLink4URL: https://datasheet.ciiva.com/22631/1703983-22631100.pdf?src-supplier=Element14; ComponentLink4Description: https://datasheet.ciiva.com/22631/1703983-22631100.pdf?src-supplier=Element14; ComponentLink5URL: https://datasheet.ciiva.com/16318/m60-2p60-16318423.pdf?src-supplier=Future+Electronics; ComponentLink5Description: https://datasheet.ciiva.com/16318/m60-2p60-16318423.pdf?src-supplier=Future+Electronics
TP14-TP17 = TP: Red Test Point; Manufacturer: Keystone; Manufacturer Part Number: 5000; Description: Interconnection Device; Supplier 1: Mouser; Supplier Part Number 1: 534-5000; RoHS: Yes; Category: Connectors; Stock 1: 320297; Pricing 1: 1=0.29, 10=0.29, 50=0.262, 100=0.222, 1000=0.173, 10000=0.143 (USD); Contact Finish - Termination: Silver (Ag); JESD-609 Code: e4; Connector Type: Interconnection Device; Reach SVHC Compliant: Yes; RoHS Compliant: Yes; ComponentLink1URL: https://datasheet.ciiva.com:443/pdfs/VipMasterIC/IC/KEYC/KEYCS01036/KEYCS02044-1.pdf?src-supplier=IHS+Markit; ComponentLink1Description: https://datasheet.ciiva.com:443/pdfs/VipMasterIC/IC/KEYC/KEYCS01036/KEYCS02044-1.pdf?src-supplier=IHS+Markit; ComponentLink2URL: https://datasheet.ciiva.com/11836/0900766b8009b7c7-11836046.pdf?src-supplier=Rs; ComponentLink2Description: https://datasheet.ciiva.com/11836/0900766b8009b7c7-11836046.pdf?src-supplier=Rs
U1 = ESP32: ESP-WROOM-32 ESP32 ESP-32S Development Board 2.4GHz Dual-Mode WiFi + Bluetooth Dual Cores Microcontroller Processor Integrated with Antenna RF AMP Filter AP STA; Manufacturer: Amazon(AITRIP); Manufacturer Part Number: B08D5ZD528
U2 = Booster/Charger: Lithium Battery Fast Charging Boost Mobile Power Protection PCB Board; Manufacturer: Amazon(AEDIKO); Manufacturer Part Number: B09X9VMGV4
U3 = NMA0505SC: DC DC CONVERTER +/-5V 1W; Manufacturer: Murata; Manufacturer Part Number: NMA0505SC
U4 = CMP-0188-01159-1: 16-Bit, Multi-Channel Delta-Sigma Analog-to-Digital Converter with I2C Interface and On-Board Reference, 14-Pin SOIC 150mil, Extended Temperature; Manufacturer: Microchip Tech; Address: 000; DatasheetVersion: revA, Dec-2009; ComponentLink2URL: http://ww1.microchip.com/downloads/en/DeviceDoc/22226a.pdf; ComponentLink1URL: http://www.microchip.com/; PackageVersion: revBB, Aug-2009; ComponentLink2Description: Datasheet; PackageReference: SOIC-SL14; PackageDescription: 14-Lead Plastic Small Outline (SL) - Narrow, 3.90mm Body [SOIC]; ComponentLink3URL: http://www.microchip.com/stellent/groups/techpub_sg/documents/packagingspec/en012702.pdf; ComponentLink1Description: Manufacturer URL; Code_IPC: SOIC127P600-14; Code_JEDEC: MS-012-AB; ComponentLink3Description: Package Specification
U5 = CMP-0188-01159-1: 16-Bit, Multi-Channel Delta-Sigma Analog-to-Digital Converter with I2C Interface and On-Board Reference, 14-Pin SOIC 150mil, Extended Temperature; Manufacturer: Microchip Tech; Address: 010; DatasheetVersion: revA, Dec-2009; ComponentLink2URL: http://ww1.microchip.com/downloads/en/DeviceDoc/22226a.pdf; ComponentLink1URL: http://www.microchip.com/; PackageVersion: revBB, Aug-2009; ComponentLink2Description: Datasheet; PackageReference: SOIC-SL14; PackageDescription: 14-Lead Plastic Small Outline (SL) - Narrow, 3.90mm Body [SOIC]; ComponentLink3URL: http://www.microchip.com/stellent/groups/techpub_sg/documents/packagingspec/en012702.pdf; ComponentLink1Description: Manufacturer URL; Code_IPC: SOIC127P600-14; Code_JEDEC: MS-012-AB; ComponentLink3Description: Package Specification

## Nets that join several sheets
+5V1: Amp_Measurement (6 pins), Volt_Measurement (12 pins), Data-Power (C12.2 TP15.1 U3.?4)
-5V1: Amp_Measurement (C6.1 U6.11), Volt_Measurement (C8.1 C10.1 U7.11 U8.11), Data-Power (C11.2 TP16.1 U3.?5)
GND: Amp_Measurement (14 pins), Volt_Measurement (28 pins), Data-Power (20 pins)
NetR10_1: Amp_Measurement (R10.1 R11.1 R12.2 TP12.1), Data-Power (U5.3)
NetR17_1: Amp_Measurement (R17.1 R18.1 R19.2 TP13.1), Data-Power (U5.4)
NetR24_1: Volt_Measurement (R24.1 R25.2 R29.2 TP2.1), Data-Power (U4.1)
NetR27_1: Volt_Measurement (R27.1 R33.2 R39.2 TP4.1), Data-Power (U4.3)
NetR30_1: Amp_Measurement (R30.1 R31.1 R32.2 TP10.1), Data-Power (U5.1)
NetR35_1: Amp_Measurement (R35.1 R36.1 R37.2 TP11.1), Data-Power (U5.2)
NetR41_1: Volt_Measurement (R41.1 R42.2 R45.2 TP3.1), Data-Power (U4.2)
NetR44_1: Volt_Measurement (R44.1 R47.2 R49.2 TP5.1), Data-Power (U4.4)
NetR51_1: Volt_Measurement (R51.1 R52.2 R56.2 TP6.1), Data-Power (U4.11)
NetR54_1: Volt_Measurement (R54.1 R57.2 R60.2 TP8.1), Data-Power (U4.13)
NetR61_1: Volt_Measurement (R61.1 R62.2 R65.2 TP7.1), Data-Power (U4.12)
NetR64_1: Volt_Measurement (R64.1 R67.2 R69.2 TP9.1), Data-Power (U4.14)